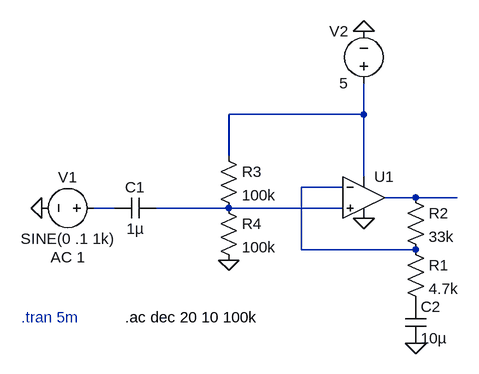
[diagram p0: schematic Project2PreAmp.asc]
Project2PreAmp.asc, the LTspice schematic file:
Version 4.1
SHEET 1 880 680
WIRE 176 16 176 -32
WIRE 176 16 -32 16
WIRE -32 80 -32 16
WIRE 176 112 176 16
WIRE 144 128 80 128
WIRE 256 144 208 144
WIRE 320 144 256 144
WIRE -208 160 -240 160
WIRE -32 160 -144 160
WIRE 144 160 -32 160
WIRE 80 224 80 128
WIRE 256 224 80 224
FLAG 176 176 0
FLAG 176 -112 0
FLAG -320 160 0
FLAG -32 240 0
FLAG 256 368 0
SYMBOL OpAmps\\UniversalOpAmp2 176 144 R0
SYMATTR InstName U1
SYMATTR Value2 Avol=200k GBW=3Meg Slew=13Meg
SYMATTR SpiceLine Ilimit=10m Rail=1.5 Vos=3m
SYMATTR SpiceLine2 En=37n Enk=0 In=0 Ink=0 Rin=500Meg
SYMBOL res 240 128 R0
SYMATTR InstName R2
SYMATTR Value 33k
SYMBOL res 240 208 R0
SYMATTR InstName R1
SYMATTR Value 4.7k
SYMBOL voltage 176 -16 R180
WINDOW 0 24 96 Left 2
WINDOW 3 24 16 Left 2
WINDOW 123 0 0 Left 0
WINDOW 39 0 0 Left 0
SYMATTR InstName V2
SYMATTR Value 5
SYMBOL voltage -224 160 R90
WINDOW 0 -32 56 VBottom 2
WINDOW 3 32 56 VTop 2
WINDOW 123 60 56 VTop 2
WINDOW 39 0 0 Left 0
SYMATTR InstName V1
SYMATTR Value SINE(0 .1 1k)
SYMATTR Value2 AC 1
SYMBOL cap -144 144 R90
WINDOW 0 0 32 VBottom 2
WINDOW 3 32 32 VTop 2
SYMATTR InstName C1
SYMATTR Value 1µ
SYMBOL res -48 64 R0
SYMATTR InstName R3
SYMATTR Value 100k
SYMBOL res -48 144 R0
SYMATTR InstName R4
SYMATTR Value 100k
SYMBOL cap 240 304 R0
SYMATTR InstName C2
SYMATTR Value 10µ
TEXT -352 328 Left 2 ;.tran 5m
TEXT -192 328 Left 2 !.ac dec 20 10 100k

The netlist it stands for:
* Project2PreAmp.asc
X§U1 N005 N002 N001 0 N003 level2 Avol=200k GBW=3Meg Slew=13Meg Ilimit=10m Rail=1.5 Vos=3m En=37n Enk=0 In=0 Ink=0 Rin=500Meg  ; pins In+ In- V+ V- OUT
R2 N003 N002 33k
R1 N002 P001 4.7k
V2 N001 0 5
V1 N004 0 SINE(0 .1 1k) AC 1
C1 N005 N004 1µ
R3 N001 N005 100k
R4 N005 0 100k
C2 P001 0 10µ
* .tran 5m
.ac dec 20 10 100k
.lib UniversalOpAmp2.lib
.backanno
.end